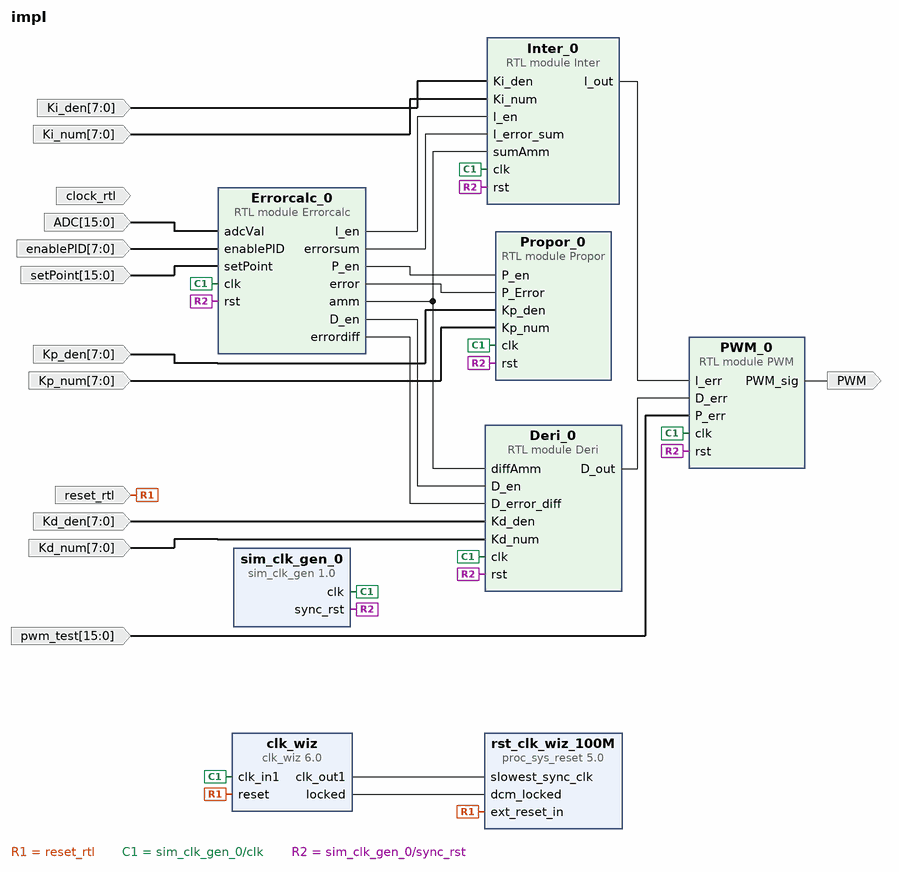
[diagram p0: block diagram of the top level]
# Vivado block design impl, xc7z020clg400-1, Vivado 2022.2
create_bd_design impl

create_bd_port -dir O PWM
create_bd_port -dir I -from 7 -to 0 Kp_den
create_bd_port -dir I -from 7 -to 0 Kp_num
create_bd_port -dir I -from 7 -to 0 Ki_den
create_bd_port -dir I -from 7 -to 0 enablePID
create_bd_port -dir I -from 15 -to 0 ADC
create_bd_port -dir I -from 15 -to 0 setPoint
create_bd_port -dir I -from 7 -to 0 Ki_num
create_bd_port -dir I -from 7 -to 0 Kd_den
create_bd_port -dir I -from 7 -to 0 Kd_num
create_bd_port -dir I -type rst reset_rtl
set_property -dict {CONFIG.POLARITY ACTIVE_HIGH} [get_bd_ports reset_rtl]
create_bd_port -dir I -type clk clock_rtl
set_property -dict {CONFIG.FREQ_HZ 125000000 CONFIG.PHASE 0.0} [get_bd_ports clock_rtl]
create_bd_port -dir I -from 15 -to 0 pwm_test

create_bd_cell -type module -reference Inter Inter_0
create_bd_cell -type module -reference Propor Propor_0
create_bd_cell -type module -reference Deri Deri_0
create_bd_cell -type module -reference Errorcalc Errorcalc_0
create_bd_cell -type ip -vlnv xilinx.com:ip:clk_wiz:6.0 clk_wiz
set_property -dict {CONFIG.CLK_IN1_BOARD_INTERFACE Custom CONFIG.USE_BOARD_FLOW true} [get_bd_cells clk_wiz]
create_bd_cell -type ip -vlnv xilinx.com:ip:proc_sys_reset:5.0 rst_clk_wiz_100M
create_bd_cell -type ip -vlnv xilinx.com:ip:sim_clk_gen:1.0 sim_clk_gen_0
set_property -dict {CONFIG.FREQ_HZ 100000000 CONFIG.RESET_POLARITY ACTIVE_HIGH} [get_bd_cells sim_clk_gen_0]
create_bd_cell -type module -reference PWM PWM_0

# ---- connections ----

connect_bd_net [get_bd_ports ADC] [get_bd_pins Errorcalc_0/adcVal]
connect_bd_net [get_bd_pins Deri_0/D_out] [get_bd_pins PWM_0/D_err]
connect_bd_net [get_bd_pins Errorcalc_0/D_en] [get_bd_pins Deri_0/D_en]
connect_bd_net [get_bd_pins Errorcalc_0/I_en] [get_bd_pins Inter_0/I_en]
connect_bd_net [get_bd_pins Errorcalc_0/P_en] [get_bd_pins Propor_0/P_en]
connect_bd_net [get_bd_pins Errorcalc_0/amm] [get_bd_pins Inter_0/sumAmm] [get_bd_pins Deri_0/diffAmm]
connect_bd_net [get_bd_pins Errorcalc_0/error] [get_bd_pins Propor_0/P_Error]
connect_bd_net [get_bd_pins Errorcalc_0/errordiff] [get_bd_pins Deri_0/D_error_diff]
connect_bd_net [get_bd_pins Errorcalc_0/errorsum] [get_bd_pins Inter_0/I_error_sum]
connect_bd_net [get_bd_pins Inter_0/I_out] [get_bd_pins PWM_0/I_err]
connect_bd_net [get_bd_ports Kd_den] [get_bd_pins Deri_0/Kd_den]
connect_bd_net [get_bd_ports Kd_num] [get_bd_pins Deri_0/Kd_num]
connect_bd_net [get_bd_ports Ki_den] [get_bd_pins Inter_0/Ki_den]
connect_bd_net [get_bd_ports Ki_num] [get_bd_pins Inter_0/Ki_num]
connect_bd_net [get_bd_ports Kp_den] [get_bd_pins Propor_0/Kp_den]
connect_bd_net [get_bd_ports Kp_num] [get_bd_pins Propor_0/Kp_num]
connect_bd_net [get_bd_pins PWM_0/PWM_sig] [get_bd_ports PWM]
connect_bd_net [get_bd_pins clk_wiz/clk_out1] [get_bd_pins rst_clk_wiz_100M/slowest_sync_clk]
connect_bd_net [get_bd_pins clk_wiz/locked] [get_bd_pins rst_clk_wiz_100M/dcm_locked]
connect_bd_net [get_bd_ports enablePID] [get_bd_pins Errorcalc_0/enablePID]
connect_bd_net [get_bd_ports pwm_test] [get_bd_pins PWM_0/P_err]
connect_bd_net [get_bd_ports reset_rtl] [get_bd_pins clk_wiz/reset] [get_bd_pins rst_clk_wiz_100M/ext_reset_in]
connect_bd_net [get_bd_ports setPoint] [get_bd_pins Errorcalc_0/setPoint]
connect_bd_net [get_bd_pins sim_clk_gen_0/clk] \
  [get_bd_pins clk_wiz/clk_in1] [get_bd_pins Inter_0/clk] [get_bd_pins Deri_0/clk] [get_bd_pins Propor_0/clk] \
  [get_bd_pins Errorcalc_0/clk] [get_bd_pins PWM_0/clk]
connect_bd_net [get_bd_pins sim_clk_gen_0/sync_rst] \
  [get_bd_pins Deri_0/rst] [get_bd_pins Propor_0/rst] [get_bd_pins Errorcalc_0/rst] [get_bd_pins Inter_0/rst] \
  [get_bd_pins PWM_0/rst]

validate_bd_design
save_bd_design
